# Altium project Grandmaster.PrjPcb
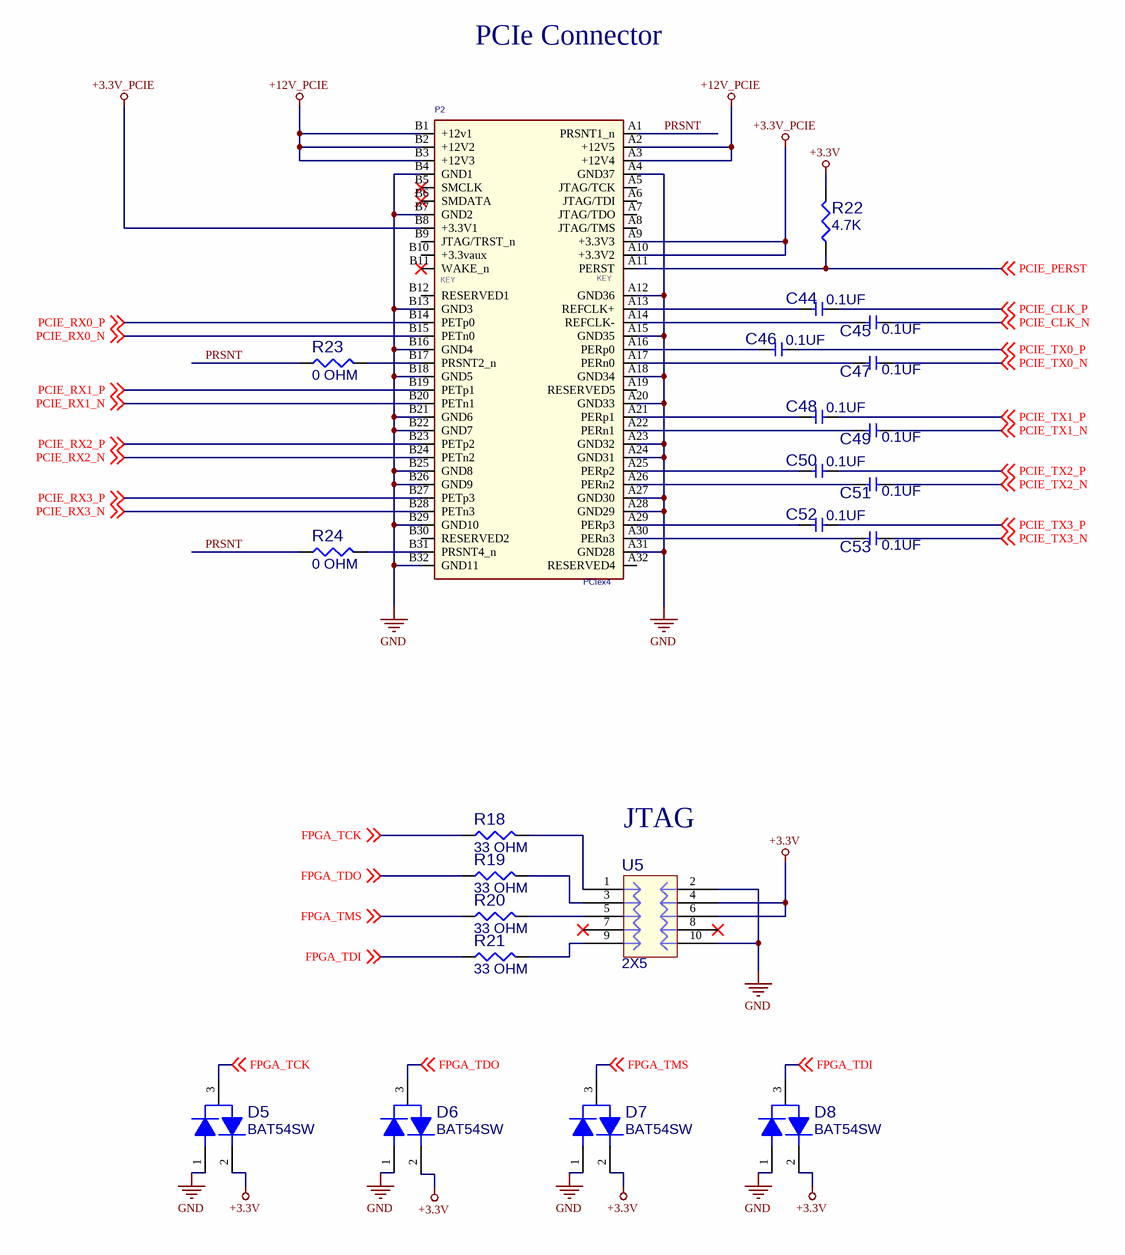
[diagram p0: PCIe-JTAG.SchDoc]
4 sheets, 118 parts. Net scope: global (net labels, ports and power ports of the same name join across sheets).
Board file: Grandmaster.PcbDoc
Sheets:
  PCIe-JTAG.SchDoc
  UART.SchDoc
  GPS-IMU.SchDoc
  MAC.SchDoc

## Sheet PCIe-JTAG.SchDoc: Grandmaster PCIe & JTAG Connectors
size Tabloid; Author: N Smith; Revision: A; SheetNumber: 2; SheetTotal: 6; Customer: 01910

### Parts
C44  value 0.1UF  [CAPC1005X06N]  (hidden comment: CAP_0402_0.1UF_50V)
C45  value 0.1UF  [CAPC1005X06N]  (hidden comment: CAP_0402_0.1UF_50V)
C46  value 0.1UF  [CAPC1005X06N]  (hidden comment: CAP_0402_0.1UF_50V)
C47  value 0.1UF  [CAPC1005X06N]  (hidden comment: CAP_0402_0.1UF_50V)
C48  value 0.1UF  [CAPC1005X06N]  (hidden comment: CAP_0402_0.1UF_50V)
C49  value 0.1UF  [CAPC1005X06N]  (hidden comment: CAP_0402_0.1UF_50V)
C50  value 0.1UF  [CAPC1005X06N]  (hidden comment: CAP_0402_0.1UF_50V)
C51  value 0.1UF  [CAPC1005X06N]  (hidden comment: CAP_0402_0.1UF_50V)
C52  value 0.1UF  [CAPC1005X06N]  (hidden comment: CAP_0402_0.1UF_50V)
C53  value 0.1UF  [CAPC1005X06N]  (hidden comment: CAP_0402_0.1UF_50V)
D5  BAT54SW  [SOT65P210X110-3N]
D6  BAT54SW  [SOT65P210X110-3N]
D7  BAT54SW  [SOT65P210X110-3N]
D8  BAT54SW  [SOT65P210X110-3N]
P2  PCIex4  [PCIE_4LANE_EDGE]
R18  value 33 OHM  [RESC2012X50N]  (hidden comment: CRCW080533R0FKEA)
R19  value 33 OHM  [RESC2012X50N]  (hidden comment: CRCW080533R0FKEA)
R20  value 33 OHM  [RESC2012X50N]  (hidden comment: CRCW080533R0FKEA)
R21  value 33 OHM  [RESC2012X50N]  (hidden comment: CRCW080533R0FKEA)
R22  value 4.7K  [RESC1608X50N]  (hidden comment: ERJ-3EKF4701V)
R23  value 0 OHM  [RESC1005X04N]  (hidden comment: ERJ-2GE0R00X)
R24  value 0 OHM  [RESC1005X04N]  (hidden comment: ERJ-2GE0R00X)
U5  value 2X5  [SAMTEC_HTST-105-01-L-DV-A]  (hidden comment: HTST-105-01-L-DV-A)

### Nets
+3.3V: D5.2 D6.2 D7.2 D8.2 R22.2 U5.4(P4) U5.6(P6)
+3.3V_PCIE: P2.A9(+3.3V3) P2.A10(+3.3V2) P2.B8(+3.3V1)
+12V_PCIE: P2.A2(+12V5) P2.A3(+12V4) P2.B1(+12v1) P2.B2(+12V2) P2.B3(+12V3)
GND: D5.1 D6.1 D7.1 D8.1 P2.A4(GND37) P2.A12(GND36) P2.A15(GND35) P2.A18(GND34) P2.A20(GND33) P2.A23(GND32) P2.A24(GND31) P2.A27(GND30) P2.A28(GND29) P2.A31(GND28) P2.B4(GND1) P2.B7(GND2) P2.B13(GND3) P2.B16(GND4) P2.B18(GND5) P2.B21(GND6) P2.B22(GND7) P2.B25(GND8) P2.B26(GND9) P2.B29(GND10) P2.B32(GND11) U5.2(P2) U5.10(P10)
FPGA_TCK: D5.3 R18.1 ; off-sheet FPGA_TCK
FPGA_TDI: D8.3 R21.1 ; off-sheet FPGA_TDI
FPGA_TDO: D6.3 R19.1 ; off-sheet FPGA_TDO
FPGA_TMS: D7.3 R20.1 ; off-sheet FPGA_TMS
PCIE_CLK_N: C45.2 ; off-sheet PCIE_CLK_N
PCIE_CLK_P: C44.2 ; off-sheet PCIE_CLK_P
PCIE_PERST: P2.A11(PERST) R22.1 ; off-sheet PCIE_PERST
PCIE_RX0_N: P2.B15(PETn0) ; off-sheet PCIE_RX0_N
PCIE_RX0_P: P2.B14(PETp0) ; off-sheet PCIE_RX0_P
PCIE_RX1_N: P2.B20(PETn1) ; off-sheet PCIE_RX1_N
PCIE_RX1_P: P2.B19(PETp1) ; off-sheet PCIE_RX1_P
PCIE_RX2_N: P2.B24(PETn2) ; off-sheet PCIE_RX2_N
PCIE_RX2_P: P2.B23(PETp2) ; off-sheet PCIE_RX2_P
PCIE_RX3_N: P2.B28(PETn3) ; off-sheet PCIE_RX3_N
PCIE_RX3_P: P2.B27(PETp3) ; off-sheet PCIE_RX3_P
PCIE_TX0_N: C47.2 ; off-sheet PCIE_TX0_N
PCIE_TX0_P: C46.2 ; off-sheet PCIE_TX0_P
PCIE_TX1_N: C49.2 ; off-sheet PCIE_TX1_N
PCIE_TX1_P: C48.2 ; off-sheet PCIE_TX1_P
PCIE_TX2_N: C51.2 ; off-sheet PCIE_TX2_N
PCIE_TX2_P: C50.2 ; off-sheet PCIE_TX2_P
PCIE_TX3_N: C53.2 ; off-sheet PCIE_TX3_N
PCIE_TX3_P: C52.2 ; off-sheet PCIE_TX3_P
PRSNT: P2.A1(PRSNT1_n) R23.1 R24.1
NetC44_1: C44.1 P2.A13(REFCLK+)
NetC45_1: C45.1 P2.A14(REFCLK-)
NetC46_1: C46.1 P2.A16(PERp0)
NetC47_1: C47.1 P2.A17(PERn0)
NetC48_1: C48.1 P2.A21(PERp1)
NetC49_1: C49.1 P2.A22(PERn1)
NetC50_1: C50.1 P2.A25(PERp2)
NetC51_1: C51.1 P2.A26(PERn2)
NetC52_1: C52.1 P2.A29(PERp3)
NetC53_1: C53.1 P2.A30(PERn3)
NetP2_B17: P2.B17(PRSNT2_n) R23.2
NetP2_B31: P2.B31(PRSNT4_n) R24.2
NetR18_2: R18.2 U5.1(P1)
NetR19_2: R19.2 U5.3(P3)
NetR20_2: R20.2 U5.5(P5)
NetR21_2: R21.2 U5.9(P9)

Not connected (* = marked no-connect by the designer): P2 A5(JTAG/TCK) A6(JTAG/TDI) A7(JTAG/TDO) A8(JTAG/TMS) A19(RESERVED5) A32(RESERVED4) B5(SMCLK)* B6(SMDATA)* B9(JTAG/TRST_n) B10(+3.3vaux) B11(WAKE_n)* B12(RESERVED1) B30(RESERVED2); U5 7(P7)* 8(P8)*

### Notes on the sheet
- PCIe Connector
- JTAG
- (in symbol PCIex4) KEY

### Library data of the parts
C44-C53 = CAP_0402_0.1UF_50V: CAP, CER, 0.1UF, 50V, 10%, X7R, AEC-Q200, 0402; MFG PART NUM: CGA2B3X7R1H104K050BB; VALENTIUM PART NUM: <VALENTIUM>; MFG NAME: TDK; MAXTEMP: 125C; MINTEMP: -55C; CATEGORY: CAP, CER; MODIFY DATE: 10/23/2013; SHEETPART: *; P1: 10%; OTHER: AEC-Q200; P2: 50V; P3: X7R; Size: 0402; DESC: CAP, CER, 0.1UF, 50V, 10%, X7R, AEC-Q200, 0402; Supplier 1: Digi-Key; Supplier Part Number 1: 445-6899-1-ND
D5-D8 = BAT54SW: DIO, SCHOTTKY, BAT54S, DUAL SERIES, 30V, 200MA, SC-70; MFG PART NUM: BAT54SWQ-7-F; VALENTIUM PART NUM: <VALENTIUM>; MFG NAME: DIODES INC; MAXTEMP: 150C; MINTEMP: -55C; P3: 200mA,200mW; MODIFY DATE: 9/4/2013; CATEGORY: DIO, SCHOTTKY; OTHER: SERIES; P1: SCHOTTKY; P2: 30V; SIZE: SC-70; SHEETPART: *; DESC: DIO, SCHOTTKY, BAT54S, DUAL SERIES, 30V, 200MA, SC-70; Supplier 1: Digi-Key; Supplier Part Number 1: BAT54SWQ-7-FDICT-ND; VALUE: BAT54SW
P2 = PCIex4: PCIE x4 Edge Connector,OrCAD Symbol,NC; Part Number: 451; Manufacturer: NA; NOTE: NC; Vendor P/N: NA; Part Type: SMT
R18-R21 = RES_0805_33: RES, 33 OHM, 1%, 1/8W, TF, 0805; VELENTIUM PART NUM: <VELENTIUM>; MFG NAME: VISHAY/DALE; MAXTEMP: 125C; MINTEMP: -55C; OTHER: 100PPM; MFG PART NUM: CRCW080533R0FKEA; CATEGORY: RES; ModifyDate: 7/26/2013; P1: 1%; P3: TF; P2: 1/8W; SIZE: 0805; Supplier 1: Digi-Key; Supplier Part Number 1: 541-33.0CCT-ND; SHEETPART: *; DESC: RES, 33 OHM, 1%, 1/8W, TF, 0805
R22 = RES_0603_4.7K: RES, 4.7K, 1%, 1/10W, TF, 0603; VELENTIUM PART NUM: <VELENTIUM>; MFG NAME: PANASONIC; MAXTEMP: 125C; MINTEMP: -55C; OTHER: 100PPM; SUB: GENERIC; ModifyDate: 7/25/2013; MFG PART NUM: ERJ-3EKF4701V; CATEGORY: RES; Date: 7/26/2013; P1: 1%; P3: TF; P2: 1/10W; SIZE: 0603; Supplier 1: Digi-Key; Supplier Part Number 1: P4.70KHCT-ND; SHEETPART: *; DESC: RES, 4.7K, 1%, 1/10W, TF, 0603
R23 R24 = RES_0402_0: RES, 0. OHM, 1%, 1/16W, TF, AEC-Q200, 0402; VELENTIUM PART NUM: <VELENTIUM>; MFG NAME: PANASONIC; MAXTEMP: 155C; MINTEMP: -55C; OTHER: 100PPM, AEC-Q200; SUB: GENERIC; DESC: RES, 0 OHM, 1%, 1/16W, TF, AEC-Q200, 0402; ModifyDate: 7/25/2013; MFG PART NUM: ERJ-2GE0R00X; CATEGORY: RES; Date: 7/26/2013; P1: 1%; P3: TF; P2: 1/16W; SIZE: 0402; SHEETPART: *; Supplier 1: Digi-Key; Supplier Part Number 1: P0.0JCT-ND
U5 = SAMTEC-HTSH-105-01-L-DV: CONN, HDR, 2X5, VERT, 0.1IN  SHROUDED, SMT, HTSH SERIES; VALENTIUM PART NUM: <VALENTIUM>; MFG NAME: SAMTEC INC; MAXTEMP: 125C; MINTEMP: -55C; MFG PART NUM: HTST-105-01-L-DV-A; MODIFY DATE: 10/10/2013; CATEGORY: CONN, HDR; OTHER: HTSH SERIES; P1: VERT; P2: 0.1 IN; P3: SHROUDED; SIZE: SMT; DESC: CONN, HDR, 2X5, VERT, 0.1IN  SHROUDED, SMT, HTSH SERIES; Supplier 1: Digi-Key; Supplier Part Number 1: SAM8809-ND

## Sheet UART.SchDoc: Grandmaster UART, Antennas, and RTC
size Tabloid; Author: N Smith; Revision: A; SheetNumber: 3; SheetTotal: 6; Customer: 01910
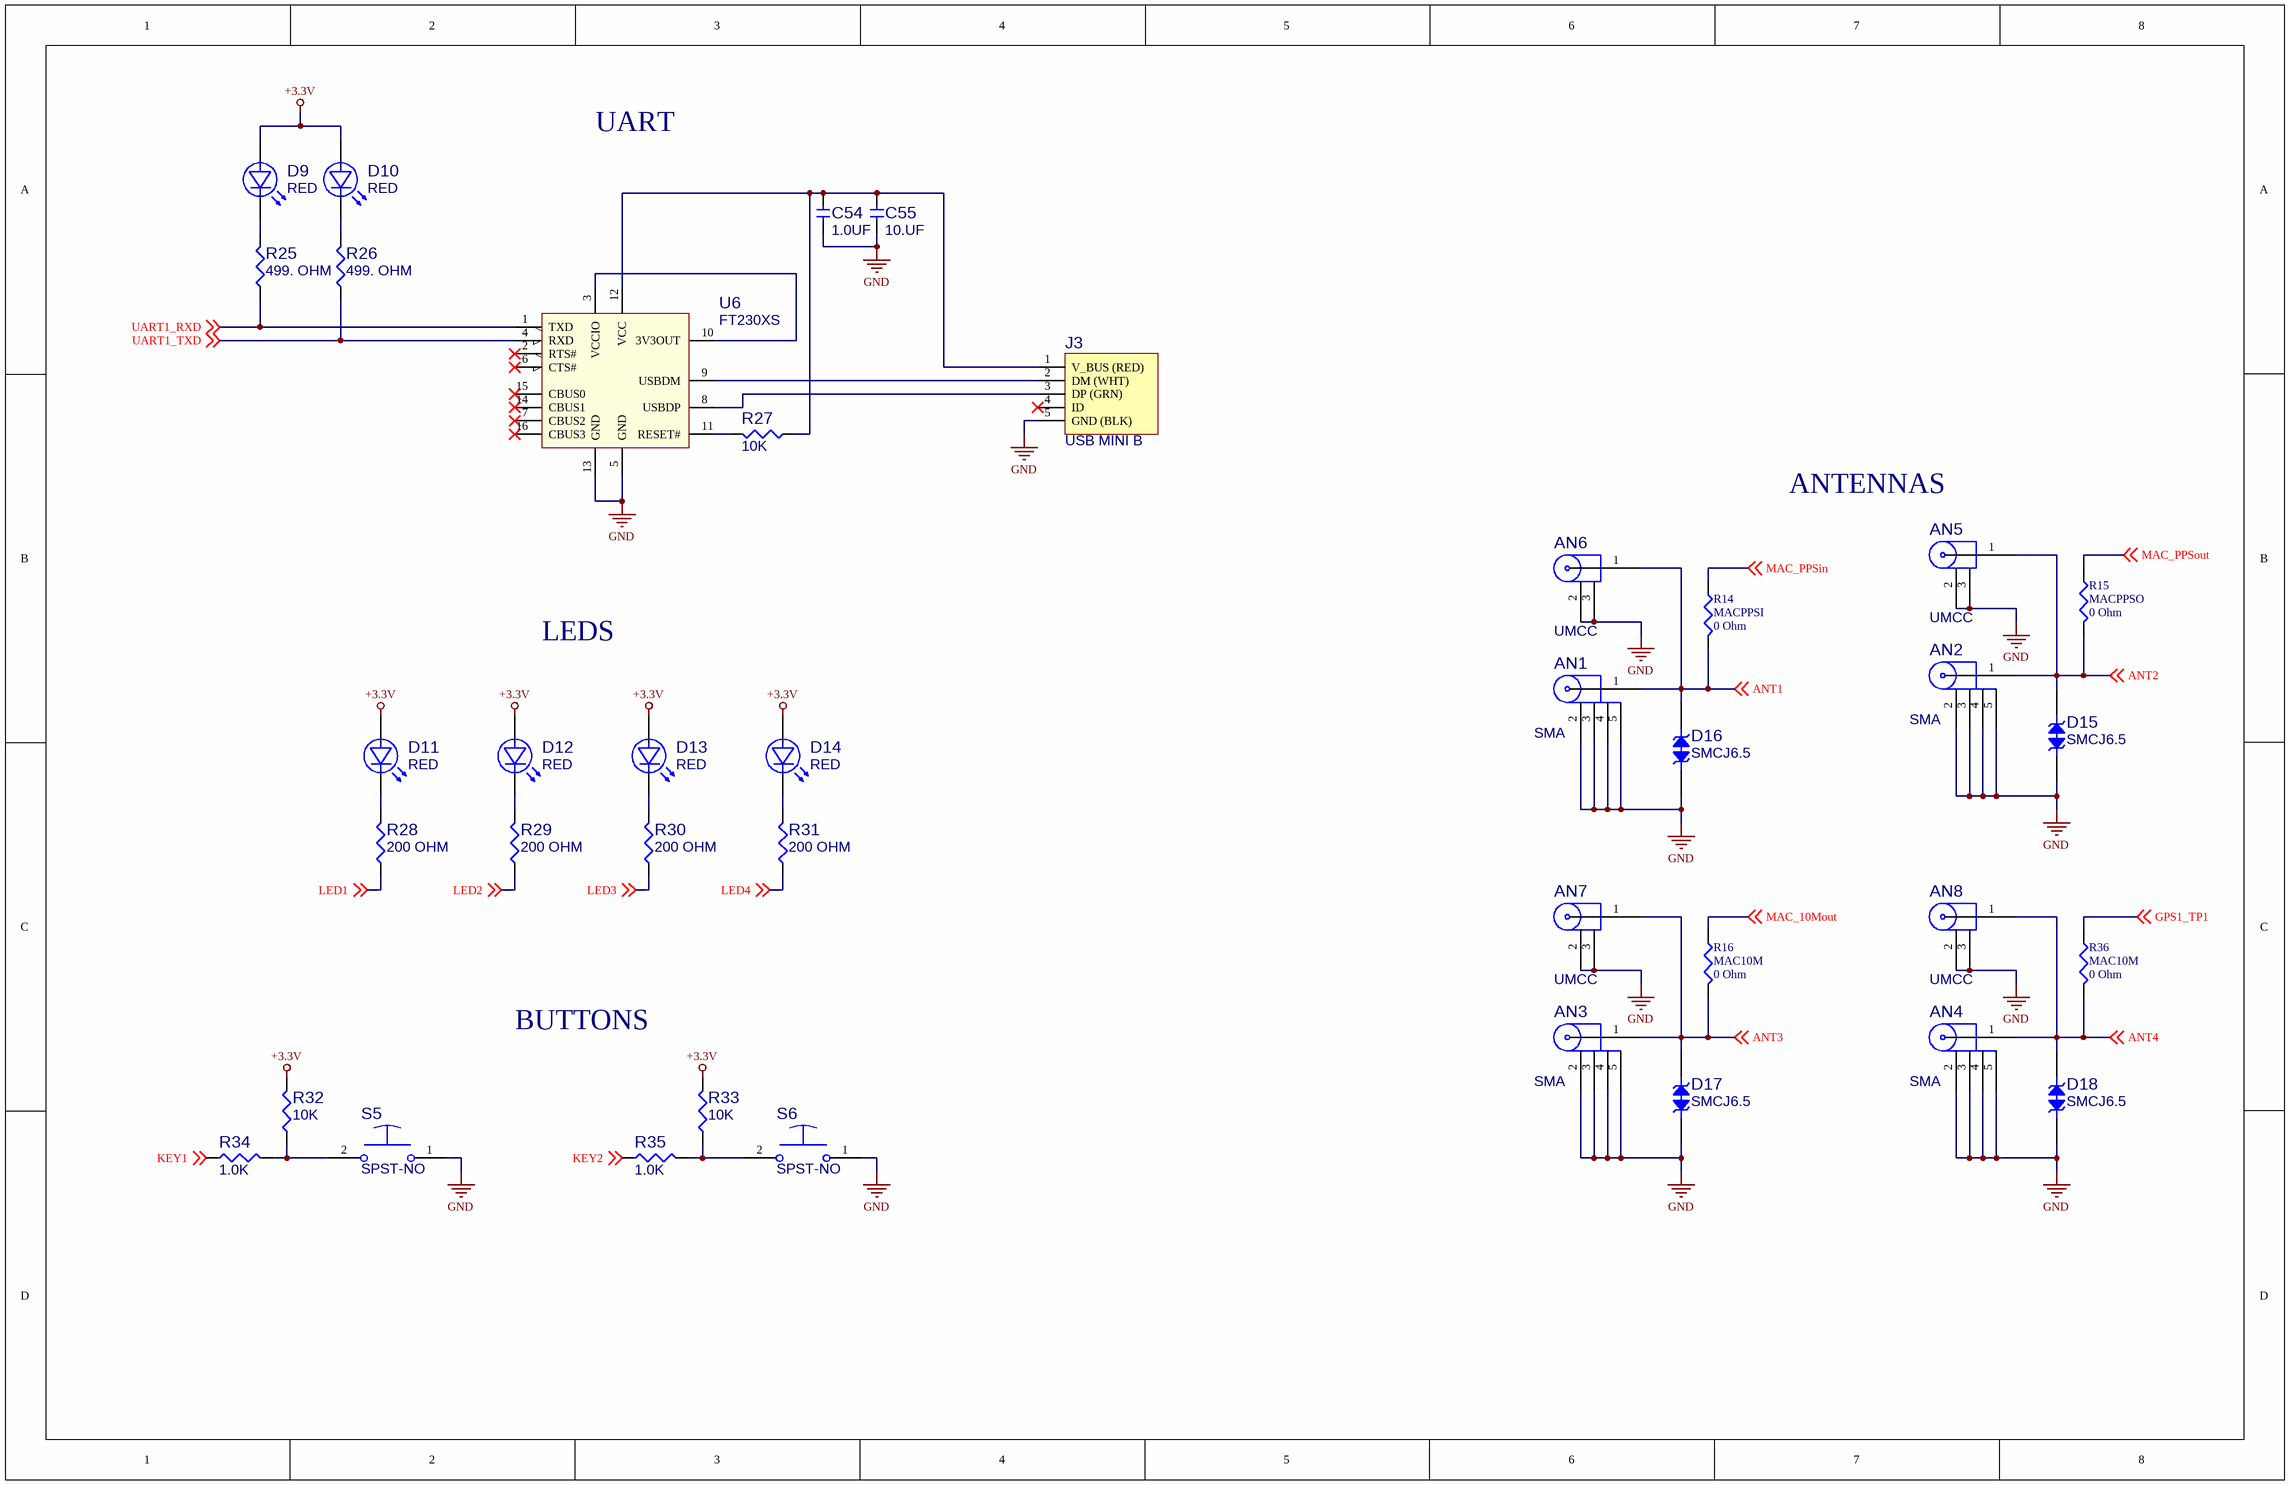
[diagram p1: UART.SchDoc]

### Parts
AN1  value SMA  [AMPHENOL-901-143-6RFX]  (hidden comment: RF-901-143-6FRX)
AN2  value SMA  [AMPHENOL-901-143-6RFX]  (hidden comment: RF-901-143-6FRX)
AN3  value SMA  [AMPHENOL-901-143-6RFX]  (hidden comment: RF-901-143-6FRX)
AN4  value SMA  [AMPHENOL-901-143-6RFX]  (hidden comment: RF-901-143-6FRX)
AN5  value UMCC  [U.FL UMCC JACK]  (hidden comment: 1909763-1)
AN6  value UMCC  [U.FL UMCC JACK]  (hidden comment: 1909763-1)
AN7  value UMCC  [U.FL UMCC JACK]  (hidden comment: 1909763-1)
AN8  value UMCC  [U.FL UMCC JACK]  (hidden comment: 1909763-1)
C54  value 1.0UF  [CAPC2012X14N]  (hidden comment: CAP_0805_1UF_25V)
C55  value 10.UF  [CAPC1608X10N]  (hidden comment: GRT188R61E106ME13D)
D9  RED  [DIOM1608X06N]
D10  RED  [DIOM1608X06N]
D11  RED  [DIOM1608X06N]
D12  RED  [DIOM1608X06N]
D13  RED  [DIOM1608X06N]
D14  RED  [DIOM1608X06N]
D15  value SMCJ6.5  [DIOM6959X26N]  (hidden comment: SMCJ6.5CA)
D16  value SMCJ6.5  [DIOM6959X26N]  (hidden comment: SMCJ6.5CA)
D17  value SMCJ6.5  [DIOM6959X26N]  (hidden comment: SMCJ6.5CA)
D18  value SMCJ6.5  [DIOM6959X26N]  (hidden comment: SMCJ6.5CA)
J3  value USB MINI B  [USB_1734035]  (hidden comment: USB_B_1734035)
R14  MACPPSI  value 0 Ohm  [J1-0603]
R15  MACPPSO  value 0 Ohm  [J1-0603]
R16  MAC10M  value 0 Ohm  [J1-0603]
R25  value 499. OHM  [RESC1005X04N]  (hidden comment: ERJ-2RKF4990X)
R26  value 499. OHM  [RESC1005X04N]  (hidden comment: ERJ-2RKF4990X)
R27  value 10K  [RESC1608X50N]  (hidden comment: ERJ-3EKF1002V)
R28  value 200 OHM  [RESC1608X50N]  (hidden comment: ERJ-3EKF2000V)
R29  value 200 OHM  [RESC1608X50N]  (hidden comment: ERJ-3EKF2000V)
R30  value 200 OHM  [RESC1608X50N]  (hidden comment: ERJ-3EKF2000V)
R31  value 200 OHM  [RESC1608X50N]  (hidden comment: ERJ-3EKF2000V)
R32  value 10K  [RESC1608X50N]  (hidden comment: ERJ-3EKF1002V)
R33  value 10K  [RESC1608X50N]  (hidden comment: ERJ-3EKF1002V)
R34  value 1.0K  [RESC1608X50N]  (hidden comment: ERJ-3EKF1001V)
R35  value 1.0K  [RESC1608X50N]  (hidden comment: ERJ-3EKF1001V)
R36  MAC10M  value 0 Ohm  [J1-0603]
S5  value SPST-NO  [OMRON-B3U-1000P]  (hidden comment: B3U-1000P)
S6  value SPST-NO  [OMRON-B3U-1000P]  (hidden comment: B3U-1000P)
U6  value FT230XS  [SOP64P600X170-16N]  (hidden comment: FT230XS-R)

### Nets
+3.3V: D9.2(A) D10.2(A) D11.2(A) D12.2(A) D13.2(A) D14.2(A) R32.2 R33.2
GND: AN1.2 AN1.3 AN1.4 AN1.5 AN2.2 AN2.3 AN2.4 AN2.5 AN3.2 AN3.3 AN3.4 AN3.5 AN4.2 AN4.3 AN4.4 AN4.5 AN5.2 AN5.3 AN6.2 AN6.3 AN7.2 AN7.3 AN8.2 AN8.3 C54.1 C55.1 D15.K D16.K D17.K D18.K J3.5(GND_(BLK)) S5.1 S6.1 U6.5(GND) U6.13(GND)
ANT1: AN1.1 AN6.1 D16.A R14.2 ; off-sheet ANT1
ANT2: AN2.1 AN5.1 D15.A R15.2 ; off-sheet ANT2
ANT3: AN3.1 AN7.1 D17.A R16.2 ; off-sheet ANT3
ANT4: AN4.1 AN8.1 D18.A R36.2 ; off-sheet ANT4
GPS1_TP1: R36.1 ; off-sheet GPS1_TP1
KEY1: R34.1 ; off-sheet KEY1
KEY2: R35.1 ; off-sheet KEY2
LED1: R28.1 ; off-sheet LED1
LED2: R29.1 ; off-sheet LED2
LED3: R30.1 ; off-sheet LED3
LED4: R31.1 ; off-sheet LED4
MAC_10Mout: R16.1 ; off-sheet MAC_10Mout
MAC_PPSin: R14.1 ; off-sheet MAC_PPSin
MAC_PPSout: R15.1 ; off-sheet MAC_PPSout
UART1_RXD: R25.1 U6.1(TXD) ; off-sheet UART1_RXD
UART1_TXD: R26.1 U6.4(RXD) ; off-sheet UART1_TXD
NetC54_2: C54.2 C55.2 J3.1(V_BUS_(RED)) R27.1 U6.12(VCC)
NetD9_1: D9.1(K) R25.2
NetD10_1: D10.1(K) R26.2
NetD11_1: D11.1(K) R28.2
NetD12_1: D12.1(K) R29.2
NetD13_1: D13.1(K) R30.2
NetD14_1: D14.1(K) R31.2
NetJ3_2: J3.2(DM_(WHT)) U6.9(USBDM)
NetJ3_3: J3.3(DP_(GRN)) U6.8(USBDP)
NetR27_2: R27.2 U6.11(RESET#)
NetR32_1: R32.1 R34.2 S5.2
NetR33_1: R33.1 R35.2 S6.2
NetU6_3: U6.3(VCCIO) U6.10(3V3OUT)

Not connected (* = marked no-connect by the designer): J3 4(ID)*; U6 2(RTS#)* 6(CTS#)* 7(CBUS2)* 14(CBUS1)* 15(CBUS0)* 16(CBUS3)*

### Notes on the sheet
- UART
- ANTENNAS
- LEDS
- BUTTONS

### Library data of the parts
AN1-AN4 = RF-901-143-6FRX: CONN, JACK, SMA, FEMALE, 50 OHM, R/A, GOLD, TH; MFG PART NUM: 901-143-6RFX; VALENTIUM PART NUM: <VALENTIUM>; MFG Name: AMPHENOL; MAXTEMP: 165C; MINTEMP: -65C; P2: 50 OHM; MODIFY DATE: 10/10/2013; CATEGORY: CONN, JACK; OTHER: GOLD; P1: FEMALE; P3: R/A; SIZE: 9.86MM HT; DESC: CONN, JACK, SMA, FEMALE, 50 OHM, R/A, GOLD, TH; Supplier 1: Digi-Key; Supplier Part Number 1: ARFX1232-ND
AN5-AN8 = UMCC: CONN, JACK, UMCC, MALE, 50 OHM, U.FL, GOLD, SMT; VALENTIUM PART NUM: <VALENTIUM>; MFG Name: TE; MAXTEMP: 90C; MINTEMP: -40C; P2: 50 OHM; P3: ST; MFG PART NUM: 1909763-1; MODIFY DATE: 10/10/2013; CATEGORY: CONN, JACK; OTHER: GOLD; P1: MALE; SIZE: 1.25MM HT; DESC: CONN, JACK, UMCC, MALE, 50 OHM, U.FL, GOLD, SMT; Supplier 1: Digi-Key; Supplier Part Number 1: A118077CT-ND
C54 = CAP_0805_1UF_25V: CAP, CER, 1.0UF, 25V, 10%, X5R, 0805; MFG PART NUM: 08053D105KAT2A; VALENTIUM PART NUM: <VALENTIUM>; MFG NAME: AVX; MAXTEMP: 85C; MINTEMP: -55C; MODIFY DATE: 10/23/2013; CATEGORY: CAP, CER; Date: 4/11/2006 3:37:28 PM; SHEETPART: *; P1: 10%; P2: 25V; P3: X5R; Size: 0805; Supplier 1: Digi-Key; Supplier Part Number 1: 478-1409-1-ND; DESC: CAP, CER, 1.0UF, 25V, 10%, X5R, 0805
C55 = CAP_0603_10UF_25V: CAP, CER, 10.UF, 25V, 20%, X5R, AEC-Q200, 0603; VALENTIUM PART NUM: <VALENTIUM>; MFG NAME: MURATA; MAXTEMP: 85C; MINTEMP: -55C; CATEGORY: CAP, CER; MFG PART NUM: GRT188R61E106ME13D; MODIFY DATE: 10/23/2013; Date: 7/25/2013; SHEETPART: *; P1: 20%; OTHER: AEC-Q200; P2: 25V; P3: X5R; Size: 0603; DESC: CAP, CER, 10.UF, 25V, 20%, X5R, AEC-Q200, 0603; Supplier 1: Digi-Key; Supplier Part Number 1: 490-12323-6-ND
D9-D14 = SMTLED_RED_0603_SML: LED, RED, SML-LX0603, 635NM, 2V, 20MA, 0603; MFG PART NUM: SML-LX0603IW-TR; VALENTIUM PART NUM: <VALENTIUM>; MFG NAME: LUMEX; MAXTEMP: 85C; MINTEMP: -25C; MODIFY DATE: 9/4/2013; CATEGORY: LED; OTHER: SML-LX0603; P1: 635NM; P2: 2V; P3: 20MA; SIZE: 0603; SHEETPART: *; DESC: LED, RED, SML-LX0603, 635NM, 2V, 20MA, 0603; Supplier 1: Digi-Key; Supplier Part Number 1: 67-1548-1-ND; VALUE: RED
D15-D18 = SMCJ6.5CA: DIO, TVS, SMCJ6.5, 6.5V, BIDIR, 1.5KW, SMC; VALENTIUM PART NUM: <VALENTIUM>; MFG NAME: LITTELFUSE; MAXTEMP: 150C; MINTEMP: -55C; OTHER: SMCJ; MFG PART NUM: SMCJ6.5CA; MODIFY DATE: 9/4/2013; CATEGORY: DIO, TVS; P1: 6.5V; P2: BIDIR; P3: 1.5KW; SIZE: SMC; SHEETPART: *; Supplier 1: Digi-Key; Supplier Part Number 1: SMCJ6.5CALFCT-ND; DESC: DIO, TVS, SMCJ6.5, 6.5V, BIDIR, 1.5KW, SMC
J3 = USB_B_1734035: CONN, REC, USB, R/A, MINI, TYPE B, 5 POS, SMT W/BRD GUIDE; MFG PART NUM: 1734035-2; VALENTIUM PART NUM: <VALENTIUM>; MFG NAME: TE CONNECTIVITY/AMP; MAXTEMP: C; P2: 5 POS; CATEGORY: CONN, REC; MODIFY DATE: 10/10/2013; MINTEMP: C; OTHER: USB; P1: R/A; P3: USB MINI B; SIZE: SMT; DESC: CONN, REC, USB, R/A, MINI, TYPE B, 5 POS, SMT W/BRD GUIDE; Supplier 1: Digi-Key; Supplier Part Number 1: A31727CT-ND
R14-R16 R36 = Res3: Resistor; Published: 8-Jun-2000; LatestRevisionDate: 29-May-2009; LatestRevisionNote: IPC-7351 Footprint Added.; PackageReference: J1-0603; Publisher: Altium Limited; PackageDescription: Chip Resistor
R25 R26 = RES_0402_499: RES, 499. OHM, 1%, 1/16W, TF, AEC-Q200, 0402; VELENTIUM PART NUM: <VELENTIUM>; MFG NAME: PANASONIC; MAXTEMP: 155C; MINTEMP: -55C; OTHER: 100PPM, AEC-Q200; SUB: GENERIC; ModifyDate: 7/25/2013; MFG PART NUM: ERJ-2RKF4990X; CATEGORY: RES; Date: 7/26/2013; P1: 1%; P3: TF; P2: 1/16W; SIZE: 0402; SHEETPART: *; DESC: RES, 499. OHM, 1%, 1/16W, TF, AEC-Q200, 0402; Supplier 1: Digi-Key; Supplier Part Number 1: P499LCT-ND
R27 R32 R33 = RES_0603_10K: RES, 10K, 1%, 1/10W, TF, 0603; VELENTIUM PART NUM: <VELENTIUM>; MFG NAME: PANASONIC; MAXTEMP: 125C; MINTEMP: -55C; OTHER: 100PPM; SUB: GENERIC; ModifyDate: 7/25/2013; MFG PART NUM: ERJ-3EKF1002V; CATEGORY: RES; Date: 7/26/2013; P1: 1%; P3: TF; P2: 1/10W; SIZE: 0603; Supplier 1: Digi-Key; Supplier Part Number 1: P10.0KHCT-ND; SHEETPART: *; DESC: RES, 10K, 1%, 1/10W, TF, 0603
R28-R31 = RES_0603_200: RES, 200 OHM, 1%, 1/10W, TF, 0603; VELENTIUM PART NUM: <VELENTIUM>; MFG NAME: PANASONIC; MAXTEMP: 125C; MINTEMP: -55C; OTHER: 100PPM; SUB: GENERIC; ModifyDate: 7/25/2013; MFG PART NUM: ERJ-3EKF2000V; CATEGORY: RES; Date: 7/26/2013; P1: 1%; P3: TF; P2: 1/10W; SIZE: 0603; SHEETPART: *; DESC: RES, 200 OHM, 1%, 1/10W, TF, 0603; Supplier 1: Digi-Key; Supplier Part Number 1: P200HCT-ND
R34 R35 = RES_0603_1.0K: RES, 1.0K, 1%, 1/10W, TF, 0603; VELENTIUM PART NUM: <VELENTIUM>; MFG NAME: PANASONIC; MAXTEMP: 125C; MINTEMP: -55C; OTHER: 100PPM; SUB: GENERIC; ModifyDate: 7/25/2013; MFG PART NUM: ERJ-3EKF1001V; CATEGORY: RES; Date: 7/26/2013; P1: 1%; P3: TF; P2: 1/10W; SIZE: 0603; Supplier 1: Digi-Key; Supplier Part Number 1: P1.00KHCT-ND; SHEETPART: *; DESC: RES, 1.0K, 1%, 1/10W, TF, 0603
S5 S6 = B3U-1000P: SW, SPST-NO, TACT, 12V, 50MA, 3X2.5MM SMT, B3U SERIES; VALENTIUM PART NUM: <VALENTIUM>; MFG NAME: OMRON; MAXTEMP: 70C; MINTEMP: -25C; MFG PART NUM: B3U-1000P; MODIFY DATE: 9/5/2013; CATEGORY: SW; OTHER: B3U SERIES; P1: 12V; P2: 50mA; P3: TACT; SIZE: 3X2.5MM; SHEETPART: *; DESC: SW, SPST-NO, TACT, 12V, 50MA, 3X2.5MM SMT, B3U SERIES; Supplier 1: Digi-Key; Supplier Part Number 1: SW1020CT-ND
U6 = FT230XS-R: IC, TCVR, FT230, USB TO UART, 5V, FTDI, 16SSOP; VELENTIUM PART NUM: <V PART NUM>; MAXTEMP: 85C; MINTEMP: -40C; MFG PART NUM: FT230XS-R; MFG NAME: FTDI; MODIFY DATE: 8/14/2013; CATEGORY: IC, TCVR; P1: USB TO UART; P2: 5V; P3: FTDI; SIZE: 20SSOP; SHEETPART: *; DESC: IC, TCVR, FT230, USB TO UART, 5V, FTDI, 16SSOP; Supplier 1: Digi-Key; Supplier Part Number 1: 768-1135-1-ND

## Sheet GPS-IMU.SchDoc: Gransmaster GPS & IMU
size Tabloid; Author: N Smith; Revision: A; SheetNumber: 4; SheetTotal: 6; Customer: 01910
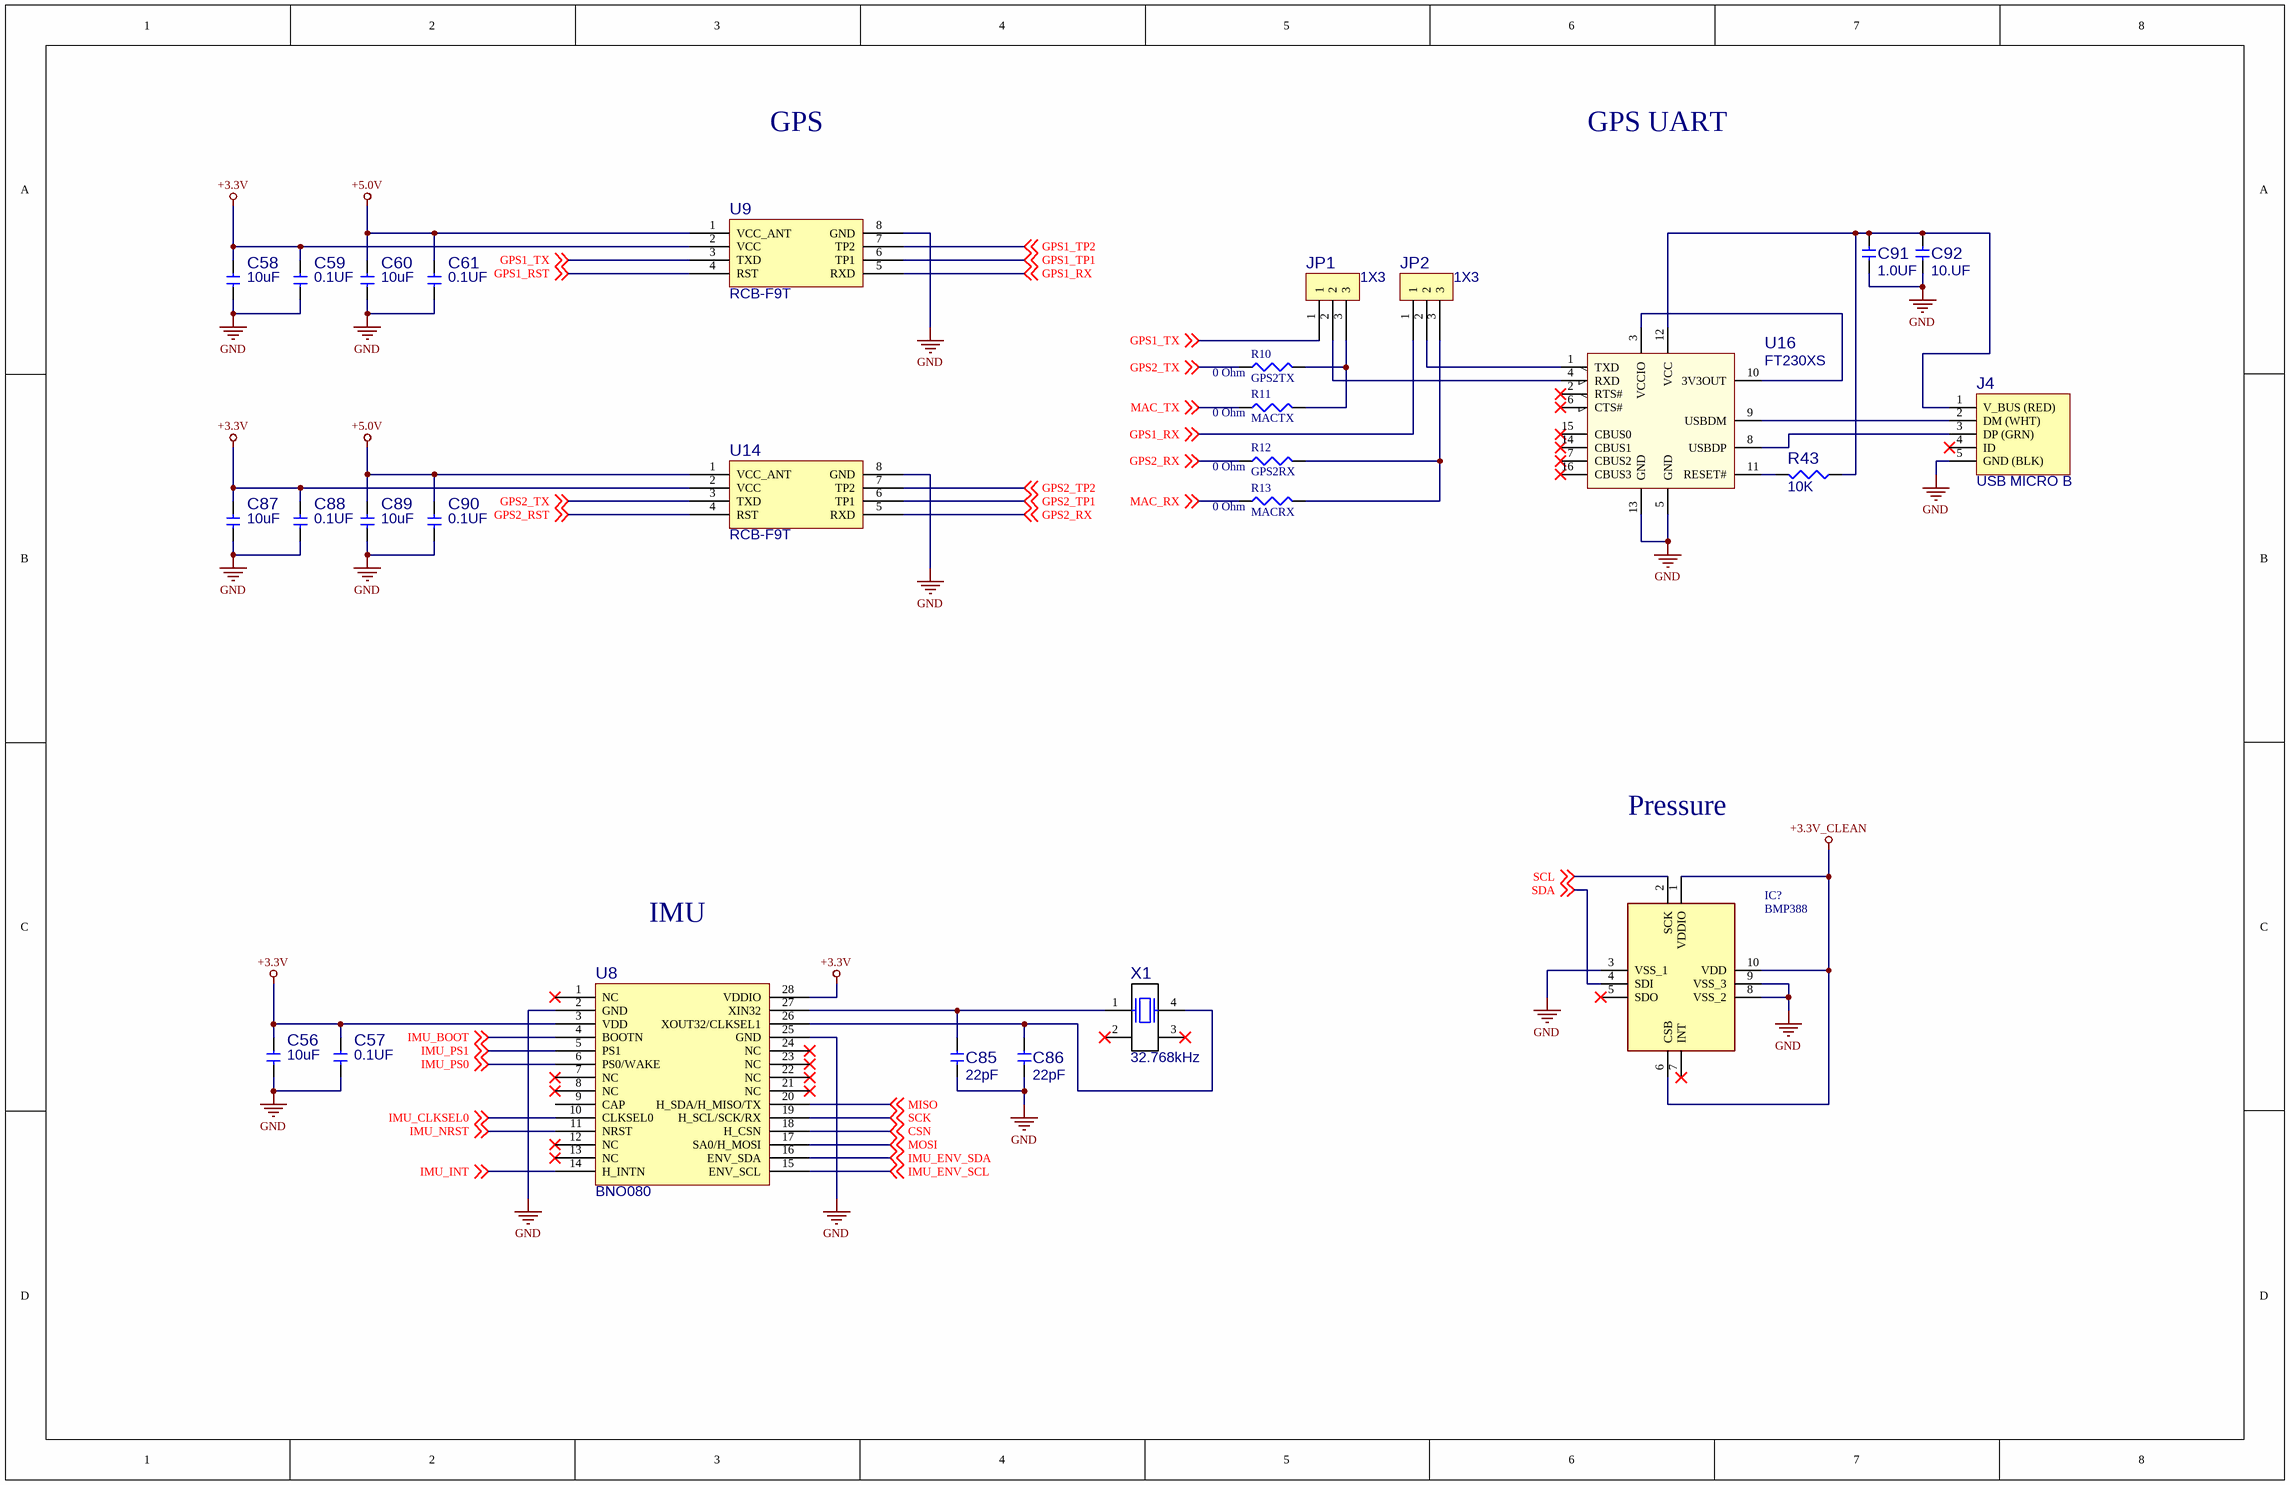
[diagram p2: GPS-IMU.SchDoc]

### Parts
C56  value 10uF  [CAPC2012X14N]  (hidden comment: CAP_0805_10UF_25V)
C57  value 0.1UF  [CAPC1005X06N]  (hidden comment: CAP_0402_0.1UF_50V)
C58  value 10uF  [CAPC2012X14N]  (hidden comment: CAP_0805_10UF_25V)
C59  value 0.1UF  [CAPC1005X06N]  (hidden comment: CAP_0402_0.1UF_50V)
C60  value 10uF  [CAPC2012X14N]  (hidden comment: CAP_0805_10UF_25V)
C61  value 0.1UF  [CAPC1005X06N]  (hidden comment: CAP_0402_0.1UF_50V)
C85  value 22pF  [CAPC1608X10N]  (hidden comment: CAP_0603_22PF_50V)
C86  value 22pF  [CAPC1608X10N]  (hidden comment: CAP_0603_22PF_50V)
C87  value 10uF  [CAPC2012X14N]  (hidden comment: CAP_0805_10UF_25V)
C88  value 0.1UF  [CAPC1005X06N]  (hidden comment: CAP_0402_0.1UF_50V)
C89  value 10uF  [CAPC2012X14N]  (hidden comment: CAP_0805_10UF_25V)
C90  value 0.1UF  [CAPC1005X06N]  (hidden comment: CAP_0402_0.1UF_50V)
C91  value 1.0UF  [CAPC2012X14N]  (hidden comment: CAP_0805_1UF_25V)
C92  value 10.UF  [CAPC1608X10N]  (hidden comment: GRT188R61E106ME13D)
IC?  BMP388  [BMP388]
J4  value USB MICRO B  [USB_47346-1001]  (hidden comment: 473461001)
JP1  value 1X3  [3PINV-100]  (hidden comment: JUMPER_3PIN)
JP2  value 1X3  [3PINV-100]  (hidden comment: JUMPER_3PIN)
R10  GPS2TX  value 0 Ohm  [J1-0603]
R11  MACTX  value 0 Ohm  [J1-0603]
R12  GPS2RX  value 0 Ohm  [J1-0603]
R13  MACRX  value 0 Ohm  [J1-0603]
R43  value 10K  [RESC1608X50N]  (hidden comment: ERJ-3EKF1002V)
U8  BNO080  [LGA-28]
U9  RCB-F9T  [RCB-F9T]
U14  RCB-F9T  [RCB-F9T]
U16  value FT230XS  [SOP64P600X170-16N]  (hidden comment: FT230XS-R)
X1  value 32.768kHz  [SM8]  (hidden comment: MC306)

### Nets
+3.3V: C56.1 C57.1 C58.1 C59.1 C87.1 C88.1 U8.3(VDD) U8.28(VDDIO) U9.2(VCC) U14.2(VCC)
+3.3V_CLEAN: IC?.1(VDDIO) IC?.6(CSB) IC?.10(VDD)
+5.0V: C60.1 C61.1 C89.1 C90.1 U9.1(VCC_ANT) U14.1(VCC_ANT)
GND: C56.2 C57.2 C58.2 C59.2 C60.2 C61.2 C85.1 C86.1 C87.2 C88.2 C89.2 C90.2 C91.1 C92.1 IC?.3(VSS_1) IC?.8(VSS_2) IC?.9(VSS_3) J4.5(GND_(BLK)) U8.2(GND) U8.25(GND) U9.8(GND) U14.8(GND) U16.5(GND) U16.13(GND)
CSN: U8.18(H_CSN) ; off-sheet CSN
GPS1_RST: U9.4(RST) ; off-sheet GPS1_RST
GPS1_RX: JP2.1 U9.5(RXD) ; off-sheet GPS1_RX
GPS1_TP1: U9.6(TP1) ; off-sheet GPS1_TP1
GPS1_TP2: U9.7(TP2) ; off-sheet GPS1_TP2
GPS1_TX: JP1.1 U9.3(TXD) ; off-sheet GPS1_TX
GPS2_RST: U14.4(RST) ; off-sheet GPS2_RST
GPS2_RX: R12.1 U14.5(RXD) ; off-sheet GPS2_RX
GPS2_TP1: U14.6(TP1) ; off-sheet GPS2_TP1
GPS2_TP2: U14.7(TP2) ; off-sheet GPS2_TP2
GPS2_TX: R10.1 U14.3(TXD) ; off-sheet GPS2_TX
IMU_BOOT: U8.4(BOOTN) ; off-sheet IMU_BOOT
IMU_CLKSEL0: U8.10(CLKSEL0) ; off-sheet IMU_CLKSEL0
IMU_ENV_SCL: U8.15(ENV_SCL) ; off-sheet IMU_ENV_SCL
IMU_ENV_SDA: U8.16(ENV_SDA) ; off-sheet IMU_ENV_SDA
IMU_INT: U8.14(H_INTN) ; off-sheet IMU_INT
IMU_NRST: U8.11(NRST) ; off-sheet IMU_NRST
IMU_PS0: U8.6(PS0/WAKE) ; off-sheet IMU_PS0
IMU_PS1: U8.5(PS1) ; off-sheet IMU_PS1
MAC_RX: R13.1 ; off-sheet MAC_RX
MAC_TX: R11.1 ; off-sheet MAC_TX
MISO: U8.20(H_SDA/H_MISO/TX) ; off-sheet MISO
MOSI: U8.17(SA0/H_MOSI) ; off-sheet MOSI
SCK: U8.19(H_SCL/SCK/RX) ; off-sheet SCK
SCL: IC?.2(SCK) ; off-sheet SCL
SDA: IC?.4(SDI) ; off-sheet SDA
NetC85_2: C85.2 U8.27(XIN32) X1.1
NetC86_2: C86.2 U8.26(XOUT32/CLKSEL1) X1.4
NetC91_2: C91.2 C92.2 J4.1(V_BUS_(RED)) R43.1 U16.12(VCC)
NetJ4_2: J4.2(DM_(WHT)) U16.9(USBDM)
NetJ4_3: J4.3(DP_(GRN)) U16.8(USBDP)
NetJP1_2: JP1.2 U16.4(RXD)
NetJP1_3: JP1.3 R10.2 R11.2
NetJP2_2: JP2.2 U16.1(TXD)
NetJP2_3: JP2.3 R12.2 R13.2
NetR43_2: R43.2 U16.11(RESET#)
NetU16_3: U16.3(VCCIO) U16.10(3V3OUT)

Not connected (* = marked no-connect by the designer): IC? 5(SDO)* 7(INT)*; J4 4(ID)*; U8 1(NC)* 7(NC)* 8(NC)* 9(CAP) 12(NC)* 13(NC)* 21(NC)* 22(NC)* 23(NC)* 24(NC)*; U16 2(RTS#)* 6(CTS#)* 7(CBUS2)* 14(CBUS1)* 15(CBUS0)* 16(CBUS3)*; X1 2* 3*

### Notes on the sheet
- GPS
- GPS UART
- Pressure
- IMU

### Library data of the parts
C56 C58 C60 C87 C89 = CAP_0805_10UF_25V: CAP, CER, 10.UF, 25V, 10%, X5R, 0805; MFG PART NUM: TMK212BBJ106KG-T; VALENTIUM PART NUM: <VALENTIUM>; MFG NAME: TAIYO YUDEN; MAXTEMP: 85C; MINTEMP: -55C; DESC: CAP, CER, 10.UF, 10V, 10%, X5R, 0805; MODIFY DATE: 10/23/2013; CATEGORY: CAP, CER; Date: 4/11/2006 3:37:28 PM; SHEETPART: *; P1: 10%; P2: 25V; P3: X5R; Size: 0805; Supplier 1: MOUSER; Supplier Part Number 1: 963-TMK212BBJ106KG-T
C57 C59 C61 C88 C90 = CAP_0402_0.1UF_50V: as C44 on sheet PCIe-JTAG; CATEGORY: CAP, CER; MODIFY DATE: 10/23/2013; SHEETPART: *; P1: 10%; OTHER: AEC-Q200; P2: 50V; P3: X7R; Size: 0402; DESC: CAP, CER, 0.1UF, 50V, 10%, X7R, AEC-Q200, 0402; Supplier 1: Digi-Key; Supplier Part Number 1: 445-6899-1-ND
C85 C86 = CAP_0603_22PF_50V: CAP, CER, 22.PF, 50V, 5%, NPO, 0603; MFG PART NUM: C0603C220J5GACTU; VALENTIUM PART NUM: <VALENTIUM>; MFG NAME: KEMET; MAXTEMP: 125C; MINTEMP: -55C; P3: NP0; CATEGORY: CAP, CER; MODIFY DATE: 10/23/2013; Date: 7/25/2013; SHEETPART: *; P1: 5%; P2: 50V; Size: 0603; Supplier 1: Digi-Key; Supplier Part Number 1: 399-1053-1-ND; DESC: CAP, CER, 22.PF, 50V, 5%, NPO, 0603
C91 = CAP_0805_1UF_25V: as C54 on sheet UART; MODIFY DATE: 10/23/2013; CATEGORY: CAP, CER; Date: 4/11/2006 3:37:28 PM; SHEETPART: *; P1: 10%; P2: 25V; P3: X5R; Size: 0805; Supplier 1: Digi-Key; Supplier Part Number 1: 478-1409-1-ND; DESC: CAP, CER, 1.0UF, 25V, 10%, X5R, 0805
C92 = CAP_0603_10UF_25V: as C55 on sheet UART; CATEGORY: CAP, CER; MFG PART NUM: GRT188R61E106ME13D; MODIFY DATE: 10/23/2013; Date: 7/25/2013; SHEETPART: *; P1: 20%; OTHER: AEC-Q200; P2: 25V; P3: X5R; Size: 0603; DESC: CAP, CER, 10.UF, 25V, 20%, X5R, AEC-Q200, 0603; Supplier 1: Digi-Key; Supplier Part Number 1: 490-12323-6-ND
IC? = BMP388: Integrated Circuit; Manufacturer_Name: Bosch Sensortec; Datasheet Link: https://ae-bst.resource.bosch.com/media/_tech/media/datasheets/BST-BMP388-DS001-01.pdf; Height: 0mm; Manufacturer_Part_Number: BMP388; Arrow Part Number: BMP388; Arrow Price/Stock: https://www.arrow.com/en/products/bmp388/bosch; Mouser Part Number: 262-BMP388; Mouser Price/Stock: https://www.mouser.co.uk/ProductDetail/Bosch-Sensortec/BMP388?qs=rrS6PyfT74eIcD5Rv1Kf7A%3D%3D
J4 = USB_B_473461001: CONN, REC, USB, R/A, MICRO, TYPE B, 5 POS, SMT FLANGELESS; VALENTIUM PART NUM: <VALENTIUM>; MFG NAME: MOLEX; MAXTEMP: 85C; MINTEMP: -30C; P2: 5 POS; CATEGORY: CONN, REC; MODIFY DATE: 10/10/2013; OTHER: FLANGELESS; P1: R/A; P3: USB MICRO B; SIZE: SMT; MFG PART NUM: 473461001; DESC: CONN, REC, USB, R/A, MICRO, TYPE B, 5 POS, SMT FLANGELESS; Supplier 1: Digi-Key; Supplier Part Number 1: WM11228CT-ND
JP1 JP2 = JUMPER_3PIN: CONN, HDR, 1X3, VERT, .1, JUMPER, TH; MFG PART NUM: TSW-103-08-G-S; VALENTIUM PART NUM: <VALENTIUM>; MFG NAME: SAMTEC; MAXTEMP: C; OTHER: TSW-1XX; P2: .1; P3: FEATURE; CATEGORY: CONN, HDR; MODIFY DATE: 10/10/2013; MINTEMP: C; P1: VERT; SIZE: TH; Supplier 1: Digi-Key; Supplier Part Number 1: SAM1038-02-ND; DESC: CONN, HDR, 1X3, VERT, .1, JUMPER, TH
R10-R13 = Res3: Resistor; Published: 8-Jun-2000; LatestRevisionDate: 29-May-2009; LatestRevisionNote: IPC-7351 Footprint Added.; PackageReference: J1-0603; Publisher: Altium Limited; PackageDescription: Chip Resistor
R43 = RES_0603_10K: as R27 on sheet UART; ModifyDate: 7/25/2013; MFG PART NUM: ERJ-3EKF1002V; CATEGORY: RES; Date: 7/26/2013; P1: 1%; P3: TF; P2: 1/10W; SIZE: 0603; Supplier 1: Digi-Key; Supplier Part Number 1: P10.0KHCT-ND; SHEETPART: *; DESC: RES, 10K, 1%, 1/10W, TF, 0603
U8 = BNO080: MOD, IMU, 5.2X3.8, SMT; VELENTIUM PART NUM: <V PART NUM>; MFG NAME: HILLCREST; MAXTEMP: +85C; MINTEMP: -40C; MFG PART NUM: BNO080; MODIFY DATE: 10/21/2013; CATEGORY: MOD; OTHER: IMU; SIZE: 5.2X3.8; SHEETPART: *; DESC: MOD, IMU, 5.2X3.8, SMT; Supplier 1: Digi-Key; Supplier Part Number 1: 1888-1000-1-ND; VALUE: BNO080
U9 U14 = RCB-F9T: MOD, GPS; VELENTIUM PART NUM: <V PART NUM>; MFG NAME: UBLOCKS; MINTEMP: -40C; MAXTEMP: 80C; DESC: MOD BLE 4.2; MFG PART NUM: RCB-F9T; CATEGORY: MOD; MODIFY DATE: 9/11/13; P1: GPS; SHEETPART: *; DATE: .; Supplier 1: Digi-Key; Supplier Part Number 1: 672-RCB-F9T-ND
U16 = FT230XS-R: as U6 on sheet UART; MFG PART NUM: FT230XS-R; MFG NAME: FTDI; MODIFY DATE: 8/14/2013; CATEGORY: IC, TCVR; P1: USB TO UART; P2: 5V; P3: FTDI; SIZE: 20SSOP; SHEETPART: *; DESC: IC, TCVR, FT230, USB TO UART, 5V, FTDI, 16SSOP; Supplier 1: Digi-Key; Supplier Part Number 1: 768-1135-1-ND
X1 = MC306: XTAL, 32.768KHZ, 6PF LOAD CAP, SMD, ROHS; MFG PART NUM: MC-306 32.768K-E3:ROHS; VALENTIUM PART NUM: <VALENTIUM>; MFG NAME: ABRACON CORPORATION; MAXTEMP: 85C; MINTEMP: -40C; P2: 20PPM; P3: FUNDAMENTAL; OTHER: MC306, 3.8X8.00X2.54MM; DESC: XTAL, <VAL>, P1, P2, P3, EIA, OTHER; CATEGORY: XTAL; MODIFY DATE: 9/5/2013; P1: 6PF; Supplier 1: Digi-Key; Supplier Part Number 1: SER2417CT-ND; SIZE: 4-SOJ; SHEETPART: *

## Sheet MAC.SchDoc: Grandmaster MAC & Clock Generation
size Tabloid; Author: N Smith; Revision: A; SheetNumber: 5; SheetTotal: 6; Customer: 01910
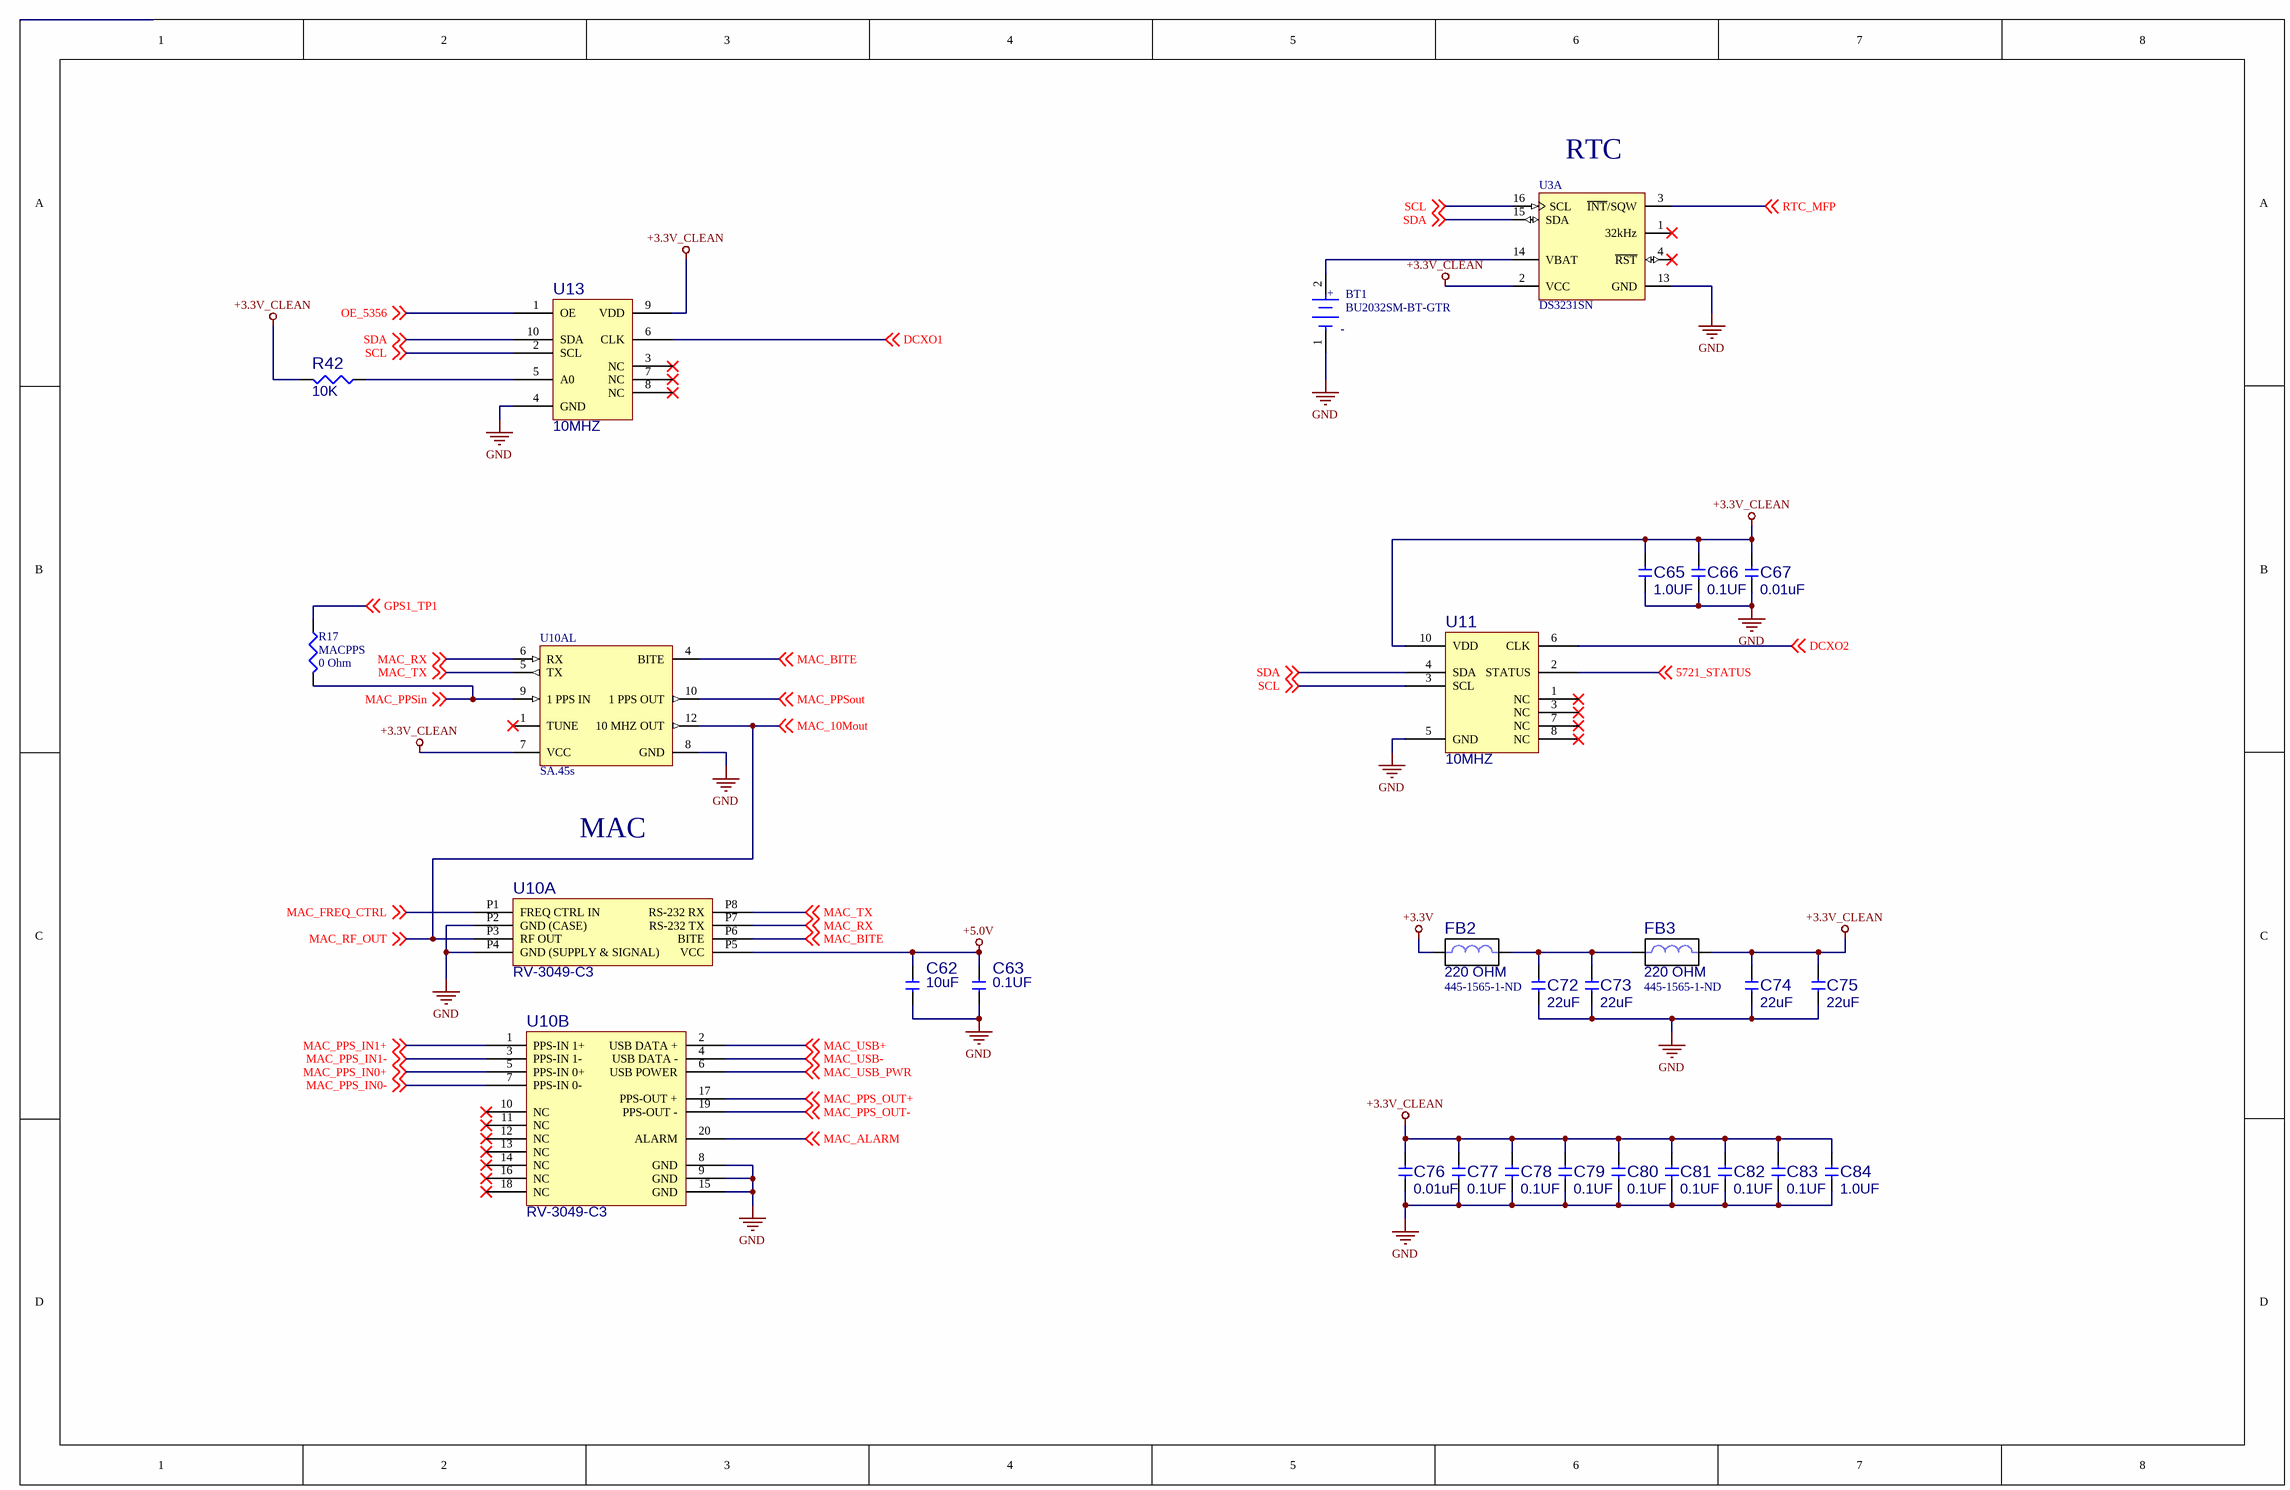
[diagram p3: MAC.SchDoc]

### Parts
BT1  BU2032SM-BT-GTR  [FP-BU2032SM-BT-GTR-MFG]
C62  value 10uF  [CAPC2012X14N]  (hidden comment: CAP_0805_10UF_25V)
C63  value 0.1UF  [CAPC1005X06N]  (hidden comment: CAP_0402_0.1UF_50V)
C65  value 1.0UF  [CAPC2012X14N]  (hidden comment: CAP_0805_1UF_50V)
C66  value 0.1UF  [CAPC1005X06N]  (hidden comment: CAP_0402_0.1UF_50V)
C67  value 0.01uF  [CAPC1608X10N]  (hidden comment: CAP_0603_0.01UF_50V)
C72  value 22uF  [CAPC2012X14N]  (hidden comment: CAP_0805_22UF_16V)
C73  value 22uF  [CAPC2012X14N]  (hidden comment: CAP_0805_22UF_16V)
C74  value 22uF  [CAPC2012X14N]  (hidden comment: CAP_0805_22UF_16V)
C75  value 22uF  [CAPC2012X14N]  (hidden comment: CAP_0805_22UF_16V)
C76  value 0.01uF  [CAPC1608X10N]  (hidden comment: CAP_0603_0.01UF_50V)
C77  value 0.1UF  [CAPC1005X06N]  (hidden comment: CAP_0402_0.1UF_50V)
C78  value 0.1UF  [CAPC1005X06N]  (hidden comment: CAP_0402_0.1UF_50V)
C79  value 0.1UF  [CAPC1005X06N]  (hidden comment: CAP_0402_0.1UF_50V)
C80  value 0.1UF  [CAPC1005X06N]  (hidden comment: CAP_0402_0.1UF_50V)
C81  value 0.1UF  [CAPC1005X06N]  (hidden comment: CAP_0402_0.1UF_50V)
C82  value 0.1UF  [CAPC1005X06N]  (hidden comment: CAP_0402_0.1UF_50V)
C83  value 0.1UF  [CAPC1005X06N]  (hidden comment: CAP_0402_0.1UF_50V)
C84  value 1.0UF  [CAPC2012X14N]  (hidden comment: CAP_0805_1UF_50V)
FB2  value 220 OHM  Supplier Part Number 1: 445-1565-1-ND  [INDC1608X09N]  (hidden comment: MPZ1608_220OHM_0603)
FB3  value 220 OHM  Supplier Part Number 1: 445-1565-1-ND  [INDC1608X09N]  (hidden comment: MPZ1608_220OHM_0603)
R17  MACPPS  value 0 Ohm  [J1-0603]
R42  value 10K  [RESC1608X50N]  (hidden comment: ERJ-3EKF1002V)
U3  DS3231SN  [W16-H2_L]  (part A of 2)
U10  value RV-3049-C3  [MAC-SA5X]  (hidden comment: MAC-SA5X)  (parts A,B of 2)
U10AL  SA.45s  [MCSM-090-02984-00X]
U11  value 10MHZ  [SIT5721]  (hidden comment: SiT5721AI-KWA33-T-10.000000)
U13  value 10MHZ  [SIT5155]  (hidden comment: SiT5356AI-FQA33-IT-10.000000)

### Nets
+3.3V: FB2.1
+3.3V_CLEAN: C65.2 C66.2 C67.2 C74.2 C75.2 C76.2 C77.2 C78.2 C79.2 C80.2 C81.2 C82.2 C83.2 C84.2 FB3.2 R42.2 U3.2(VCC) U10AL.7(VCC) U11.10(VDD) U13.9(VDD)
+5.0V: C62.1 C63.1 U10.P5(VCC)
GND: BT1.1(C) C62.2 C63.2 C65.1 C66.1 C67.1 C72.1 C73.1 C74.1 C75.1 C76.1 C77.1 C78.1 C79.1 C80.1 C81.1 C82.1 C83.1 C84.1 U3.13(GND) U10.8(GND) U10.9(GND) U10.15(GND) U10.P2(GND_(CASE)) U10.P4(GND_(SUPPLY_&_SIGNAL)) U10AL.8(GND) U11.5(GND) U13.4(GND)
5721_STATUS: U11.2(STATUS) ; off-sheet 5721_STATUS
DCXO1: U13.6(CLK) ; off-sheet DCXO1
DCXO2: U11.6(CLK) ; off-sheet DCXO2
GPS1_TP1: R17.1 ; off-sheet GPS1_TP1
MAC_10Mout: U10.P3(RF_OUT) U10AL.12(10_MHZ_OUT) ; off-sheet MAC_RF_OUT, off-sheet MAC_10Mout  [also labelled MAC_RF_OUT]
MAC_ALARM: U10.20(ALARM) ; off-sheet MAC_ALARM
MAC_BITE: U10.P6(BITE) U10AL.4(BITE) ; off-sheet MAC_BITE
MAC_FREQ_CTRL: U10.P1(FREQ_CTRL_IN) ; off-sheet MAC_FREQ_CTRL
MAC_PPS_IN0+: U10.5(PPS-IN_0+) ; off-sheet MAC_PPS_IN0+
MAC_PPS_IN0-: U10.7(PPS-IN_0-) ; off-sheet MAC_PPS_IN0-
MAC_PPS_IN1+: U10.1(PPS-IN_1+) ; off-sheet MAC_PPS_IN1+
MAC_PPS_IN1-: U10.3(PPS-IN_1-) ; off-sheet MAC_PPS_IN1-
MAC_PPS_OUT+: U10.17(PPS-OUT_+) ; off-sheet MAC_PPS_OUT+
MAC_PPS_OUT-: U10.19(PPS-OUT_-) ; off-sheet MAC_PPS_OUT-
MAC_PPSin: R17.2 U10AL.9(1_PPS_IN) ; off-sheet MAC_PPSin
MAC_PPSout: U10AL.10(1_PPS_OUT) ; off-sheet MAC_PPSout
MAC_RX: U10.P7(RS-232_TX) U10AL.6(RX) ; off-sheet MAC_RX
MAC_TX: U10.P8(RS-232_RX) U10AL.5(TX) ; off-sheet MAC_TX
MAC_USB+: U10.2(USB_DATA_+) ; off-sheet MAC_USB+
MAC_USB-: U10.4(USB_DATA_-) ; off-sheet MAC_USB-
MAC_USB_PWR: U10.6(USB_POWER) ; off-sheet MAC_USB_PWR
OE_5356: U13.1(OE) ; off-sheet OE_5356
RTC_MFP: U3.3(~{INT}/SQW) ; off-sheet RTC_MFP
SCL: U3.16(SCL) U11.3(SCL) U13.2(SCL) ; off-sheet SCL
SDA: U3.15(SDA) U11.4(SDA) U13.10(SDA) ; off-sheet SDA
NetBT1_2: BT1.2(A) U3.14(VBAT)
NetC72_2: C72.2 C73.2 FB2.2 FB3.1
NetR42_1: R42.1 U13.5(A0)

Not connected (* = marked no-connect by the designer): U3 1(32kHz)* 4(~{RST})*; U10 10(NC)* 11(NC)* 12(NC)* 13(NC)* 14(NC)* 16(NC)* 18(NC)*; U10AL 1(TUNE)*; U11 1(NC)* 7(NC)* 8(NC)*; U13 3(NC)* 7(NC)* 8(NC)*

### Notes on the sheet
- (near U3) RTC
- MAC
- (in symbol CMP-136216-000002-1) +; -

### Library data of the parts
BT1 = CMP-136216-000002-1: BATTERY HOLDER COIN 20MM SMD; Number of Cells: 1; Termination: SMD/SMT; Mount: Surface Mount; Max Operating Temperature: 280°C; Min Operating Temperature: -40°C; Package Quantity: 400; Case/Package: SMD/SMT
C62 = CAP_0805_10UF_25V: as C56 on sheet GPS-IMU; MODIFY DATE: 10/23/2013; CATEGORY: CAP, CER; Date: 4/11/2006 3:37:28 PM; SHEETPART: *; P1: 10%; P2: 25V; P3: X5R; Size: 0805; Supplier 1: MOUSER; Supplier Part Number 1: 963-TMK212BBJ106KG-T
C63 C66 C77-C83 = CAP_0402_0.1UF_50V: as C44 on sheet PCIe-JTAG; CATEGORY: CAP, CER; MODIFY DATE: 10/23/2013; SHEETPART: *; P1: 10%; OTHER: AEC-Q200; P2: 50V; P3: X7R; Size: 0402; DESC: CAP, CER, 0.1UF, 50V, 10%, X7R, AEC-Q200, 0402; Supplier 1: Digi-Key; Supplier Part Number 1: 445-6899-1-ND
C65 C84 = CAP_0805_1UF_50V: CAP, CER, 1.0UF, 50V, 10%, X7R, 0805; MFG PART NUM: GCM21BR71H105KA03L; VALENTIUM PART NUM: <VALENTIUM>; MFG NAME: MURATA; MAXTEMP: 125C; MINTEMP: -55C; OTHER: AEC-Q200; MODIFY DATE: 10/23/2013; CATEGORY: CAP, CER; Date: 10/31/2006 2:46:38 PM; SHEETPART: *; P1: 10%; P2: 50V; P3: X7R; Size: 0805; DESC: CAP, CER, 1.0UF, 50V, 10%, X7R, 0805; Supplier 1: Digi-Key; Supplier Part Number 1: 490-10675-1-ND
C67 C76 = CAP_0603_0.01UF_50V: CAP, CER, 0.01UF, 50V, 10%, X7R, 0603; MFG PART NUM: C0603C103K5RACTU; VALENTIUM PART NUM: <VALENTIUM>; MFG NAME: KEMET; MAXTEMP: 125C; MINTEMP: -55C; CATEGORY: CAP, CER; MODIFY DATE: 10/23/2013; Date: 7/24/2013; SHEETPART: *; P1: 10%; P2: 50V; P3: X7R; Size: 0603; Supplier 1: Digi-Key; Supplier Part Number 1: 399-1091-1-ND; DESC: CAP, CER, 0.01UF, 50V, 10%, X7R, 0603
C72-C75 = CAP_0805_22UF_16V: CAP, CER, 22.UF, 16V, 20%, X5R, 0805; MFG PART NUM: GRM219R61C226ME15L; VALENTIUM PART NUM: <VALENTIUM>; MFG NAME: MURATA; MAXTEMP: 85C; MINTEMP: -55C; MODIFY DATE: 10/23/2013; CATEGORY: CAP, CER; Date: 4/11/2006 3:37:28 PM; SHEETPART: *; P1: 20%; P2: 16V; P3: X5R; Size: 0805; DESC: CAP, CER, 22.UF, 16V, 20%, X5R, 0805; Supplier 1: Digi-Key; Supplier Part Number 1: 490-9952-1-ND
FB2 FB3 = MPZ1608_220OHM_0603: FER, 220 OHM, 100MHZ, 2.2A, 0.05OHM DC, MPZ1608, 0603; MFG PART NUM: MPZ1608S221ATA00; VALENTIUM PART NUM: <VALENTIUM>; MFG NAME: TDK CORP; MAXTEMP: 125C; MINTEMP: -55C; MODIFY DATE: 9/4/2013; CATEGORY: FERRITE; Date: 8/6/2013; P1: 100MHZ; P2: 2.2A; P3: 0.05 OHM; SIZE: 0603; SHEETPART: *; DESC: FER, 220 OHM, 100MHZ, 2.2A, 0.05OHM DC, MPZ1608, 0603; OTHER: MPZ1608; Supplier 1: Digi-Key
R17 = Res3: Resistor; Published: 8-Jun-2000; LatestRevisionDate: 29-May-2009; LatestRevisionNote: IPC-7351 Footprint Added.; PackageReference: J1-0603; Publisher: Altium Limited; PackageDescription: Chip Resistor
R42 = RES_0603_10K: as R27 on sheet UART; ModifyDate: 7/25/2013; MFG PART NUM: ERJ-3EKF1002V; CATEGORY: RES; Date: 7/26/2013; P1: 1%; P3: TF; P2: 1/10W; SIZE: 0603; Supplier 1: Digi-Key; Supplier Part Number 1: P10.0KHCT-ND; SHEETPART: *; DESC: RES, 10K, 1%, 1/10W, TF, 0603
U3 = CMP-0254-00293-1: Extremely Accurate I2C-Integrated Real-Time Clock/TCXO/Crystal, 16-Pin SO, -40 to 85 degC; ComponentLink1Description: Manufacturer URL; ComponentLink3URL: http://pdfserv.maxim-ic.com/package_dwgs/21-0042.PDF; ComponentLink3Description: Package Specification; PackageVersion: revD, 2010; ComponentLink2URL: http://datasheets.maxim-ic.com/en/ds/DS3231.pdf; ComponentLink2Description: Datasheet; PackageReference: W16-H2; Code_JEDEC: MS-013-AA; ComponentLink1URL: http://www.maxim-ic.com; PackageDescription: 16-Pin Small-Outline IC, Wide (0.3in), 1.27 mm Pitch, SOIC (W); Code_IPC: SOIC127P1030-16; DatasheetVersion: Rev 8, Jul-2010
U10 = MAC-SA5X: MOD, MAC, MAC-SA5X, ATOMIC CLOCK; VELENTIUM PART NUM: <V PART NUM>; MFG NAME: MICROCHIP; MAXTEMP: 85C; MINTEMP: -40C; OTHER: AEC-Q200; MODIFY DATE: 3/22/2006 1:36:44 PM; MFG PART NUM: MAC-SA5X; CATEGORY: MOD; P1: ATOMIC CLOCK; SHEETPART: *; DESC: MOD, MAC, MAC-SA5X, ATOMIC CLOCK
U10AL = CMP-2000-07612-1: Quantum(TM) Miniature Chip Scale Atomic Clock, 3.3 V, 10 MHz, -10 to 70 degC, 9-Pin THD, RoHS, Bulk; Manufacturer: Microsemi; Package Description: 9-Pin Through Hole Device, Body 40.64 x 35.306 mm; Manufacturer URL: http://www.microsemi.com/; Datasheet Version: 03/2017; Package Reference: 090-02984-00X; Datasheet URL: https://media.digikey.com/pdf/Data%20Sheets/Microsemi%20PDFs/090-02984-001.pdf; Mounting Technology: ThroughHole
U11 = SiT5721AI-KWA33-T-10.000000: OSC, 10MHZ, 3.3V, 5PPB, DCOCXO, SMT; VELENTIUM PART NUM: <V PART NUM>; MFG NAME: SITIME; MAXTEMP: 85C; MINTEMP: -30C; MFG PART NUM: SiT5721AI-KWA33-T-10.000000; MODIFY DATE: 9/18/2013; CATEGORY: OSC; Date: 9/18/2013; P1: OSC; P2: 3.3V; P3: 5PPB; SIZE: 9.0X7.0MM; SHEETPART: *; DESC: OSC, 10MHZ, 3.3V, 5PPB, DCOCXO, SMT
U13 = SiT5356AI-FQA33-IT-10.000000: OSC, 10MHZ, 3.3V, 100PPB, DCTCXO, SMT; VELENTIUM PART NUM: <V PART NUM>; MFG NAME: SITIME; MAXTEMP: 85C; MINTEMP: -30C; MFG PART NUM: SiT5356AI-FQA33-IT-10.000000; MODIFY DATE: 9/18/2013; CATEGORY: OSC; Date: 9/18/2013; P1: OSC; P2: 3.3V; P3: 100PPB; SIZE: 5.0X3.2MM; SHEETPART: *; DESC: OSC, 10MHZ, 3.3V, 100PPB, DCTCXO, SMT

## Nets that join several sheets
+3.3V: PCIe-JTAG (7 pins), UART (8 pins), GPS-IMU (10 pins), MAC (FB2.1)
+3.3V_CLEAN: GPS-IMU (IC?.1 IC?.6 IC?.10), MAC (20 pins)
+5.0V: GPS-IMU (6 pins), MAC (C62.1 C63.1 U10.P5)
GND: PCIe-JTAG (27 pins), UART (35 pins), GPS-IMU (24 pins), MAC (28 pins)
GPS1_TP1: UART (R36.1), GPS-IMU (U9.6), MAC (R17.1)
MAC_10Mout: UART (R16.1), MAC (U10.P3 U10AL.12)
MAC_PPSin: UART (R14.1), MAC (R17.2 U10AL.9)
MAC_PPSout: UART (R15.1), MAC (U10AL.10)
MAC_RX: GPS-IMU (R13.1), MAC (U10.P7 U10AL.6)
MAC_TX: GPS-IMU (R11.1), MAC (U10.P8 U10AL.5)
SCL: GPS-IMU (IC?.2), MAC (U3.16 U11.3 U13.2)
SDA: GPS-IMU (IC?.4), MAC (U3.15 U11.4 U13.10)